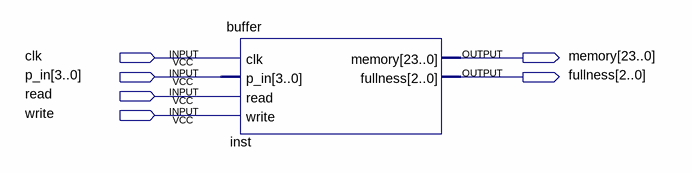
[diagram p0: schematic sheet]
// Quartus schematic buffer_sim.bdf as structural Verilog: 1 symbols, 6 pins
module buffer_sim (
  input  clk,
  input  [3:0] p_in,
  input  read,
  input  write,
  output [23:0] memory,
  output [2:0] fullness
);

  buffer inst (.clk(clk), .p_in(p_in), .read(read), .write(write), .memory(memory), .fullness(fullness));
endmodule
